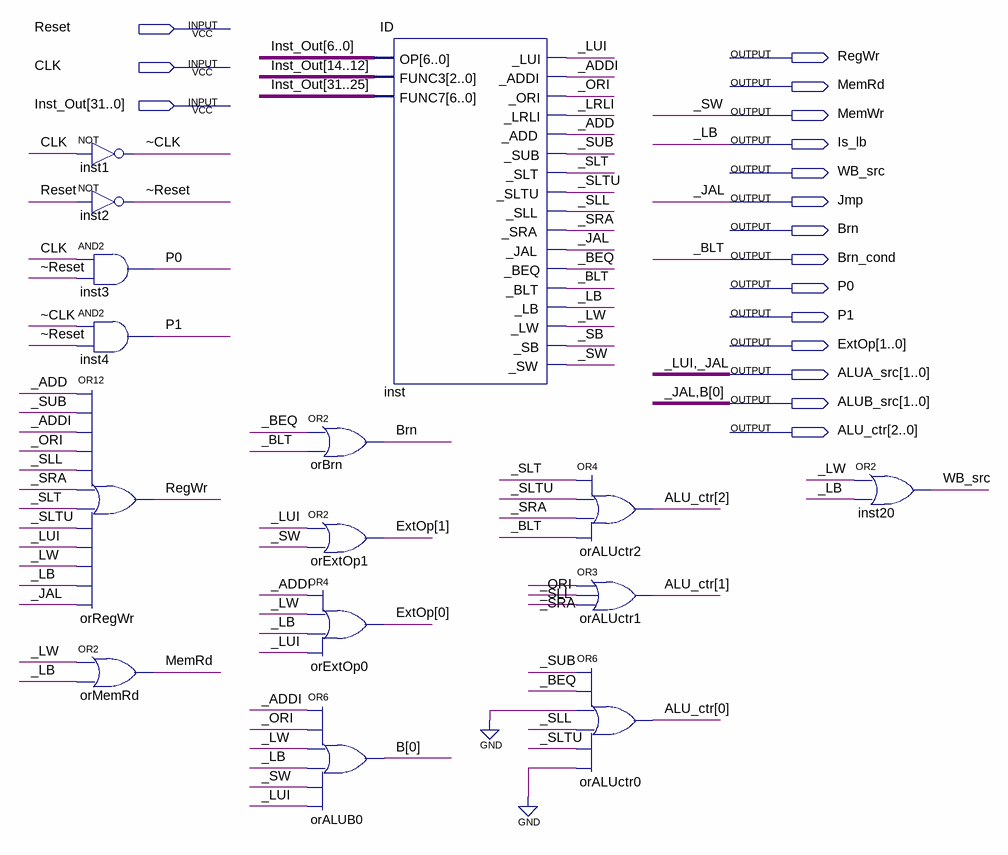
[diagram p0: schematic sheet]
// Quartus schematic CU.bdf as structural Verilog: 15 symbols, 17 pins
module CU (
  input  Reset,
  input  CLK,
  input  [31:0] Inst_Out,
  output RegWr,
  output MemRd,
  output MemWr,
  output Is_lb,
  output WB_src,
  output Jmp,
  output Brn,
  output Brn_cond,
  output P0,
  output P1,
  output [1:0] ExtOp,
  output [1:0] ALUA_src,
  output [1:0] ALUB_src,
  output [2:0] ALU_ctr
);

  wire _ADD, _ADDI, _BEQ, _LRLI, _LW, _ORI, _SB, _SLL, _SLT, _SLTU, _SRA, _SUB, \~CLK , \~Reset ;

  not inst1 (\~CLK , CLK);
  not inst2 (\~Reset , Reset);
  and inst3 (P0, CLK, \~Reset );
  and inst4 (P1, \~CLK , \~Reset );
  or orRegWr (RegWr, _ADD, _SUB, _ADDI, _ORI, _SLL, _SRA, _SLT, _SLTU, ALUA_src[1], _LW, Is_lb, ALUA_src[0]);
  or orMemRd (MemRd, _LW, Is_lb);
  or orBrn (Brn, _BEQ, Brn_cond);
  or orExtOp1 (ExtOp[1], ALUA_src[1], MemWr);
  or orExtOp0 (ExtOp[0], _ADDI, _LW, Is_lb, ALUA_src[1]);
  or orALUB0 (ALUB_src[0], _ADDI, _ORI, _LW, Is_lb, MemWr, ALUA_src[1]);
  ID inst (
    .OP(Inst_Out[6:0]), .FUNC3(Inst_Out[14:12]), .FUNC7(Inst_Out[31:25]), ._LUI(ALUA_src[1]), ._ADDI(_ADDI),
    ._ORI(_ORI), ._LRLI(_LRLI), ._ADD(_ADD), ._SUB(_SUB), ._SLT(_SLT), ._SLTU(_SLTU), ._SLL(_SLL),
    ._SRA(_SRA), ._JAL(ALUA_src[0]), ._BEQ(_BEQ), ._BLT(Brn_cond), ._LB(Is_lb), ._LW(_LW), ._SB(_SB),
    ._SW(MemWr));
  or orALUctr2 (ALU_ctr[2], _SLT, _SLTU, _SRA, Brn_cond);
  or orALUctr1 (ALU_ctr[1], _ORI, _SLL, _SRA);
  or orALUctr0 (ALU_ctr[0], _SUB, _BEQ, 1'b0, _SLL, _SLTU, 1'b0);
  or inst20 (WB_src, _LW, Is_lb);

  assign ALUB_src[1] = ALUA_src[0];
  assign Jmp = ALUA_src[0];

  // Other names for the same wires on the sheet: _BLT = Brn_cond; _JAL = ALUA_src[0]; _LB = Is_lb; _LUI = ALUA_src[1];
  //   _SW = MemWr; B[0] = ALUB_src[0]
endmodule
